# EAGLE schematic ArachnioMini (EAGLE 6.5.0)
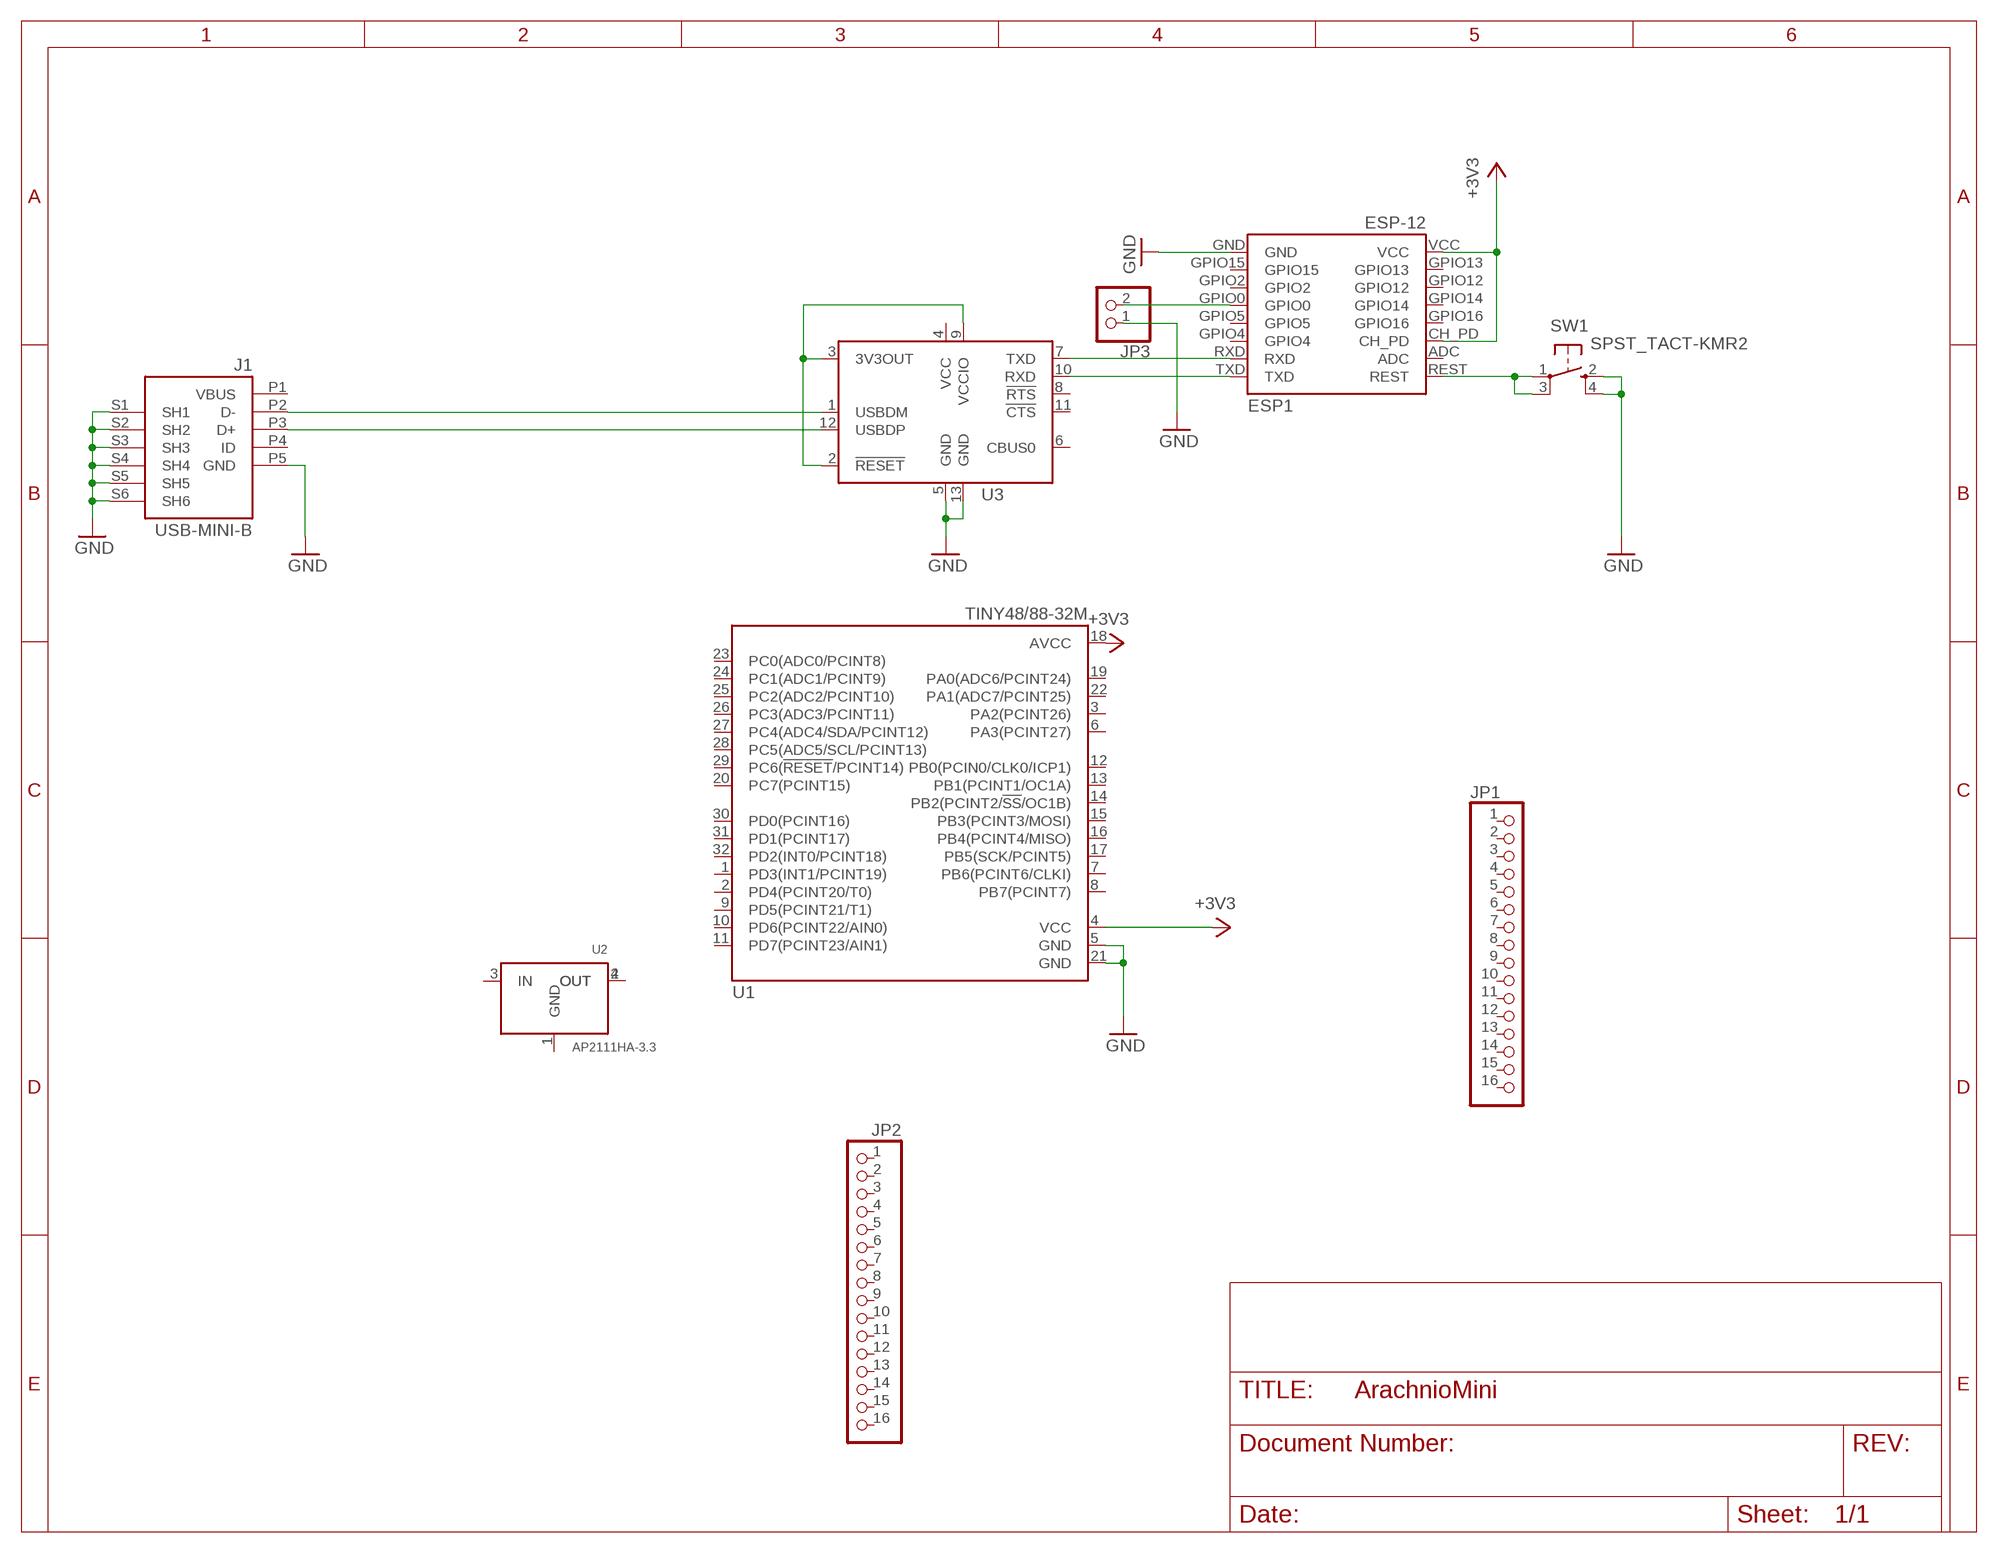
[diagram p0: schematic, sheet 1]

## Parts
ESP1  ESP-12  [ESP-12]
J1  USB-MINI-B  [SMARTPRJ_CON2_USB_MICRO_B_AT]
JP1  PINHD-1X16  [1X16]
JP2  PINHD-1X16  [1X16]
JP3  PINHD-1X2  [1X02]
SW1  SPST_TACT-KMR2  [KMR2]
U1  TINY48/88-32M  [MLF32]
U2  AP2111HA-3.3  [SOT223]
U3  FT234XD  [DFN12]

## Nets
+3V3: ESP1.CH_PD ESP1.VCC U1.4(VCC) U1.18(AVCC)
GND: ESP1.GND J1.P5(GND) J1.S1(SH1) J1.S2(SH2) J1.S3(SH3) J1.S4(SH4) J1.S5(SH5) J1.S6(SH6) JP3.1 SW1.2(S) SW1.4(S1) U1.5(GND) U1.21(GND) U3.5(GND) U3.13(GND)
N$1: ESP1.TXD U3.10(RXD)
N$2: ESP1.RXD U3.7(TXD)
N$3: U3.2(!RESET!) U3.3(3V3OUT) U3.9(VCCIO)
N$4: J1.P3(D+) U3.12(USBDP)
N$5: J1.P2(D-) U3.1(USBDM)
N$6: ESP1.GPIO0 JP3.2
N$7: ESP1.REST SW1.1(P) SW1.3(P1)
Unconnected: ESP1.ADC ESP1.GPIO2 ESP1.GPIO4 ESP1.GPIO5 ESP1.GPIO12 ESP1.GPIO13 ESP1.GPIO14 ESP1.GPIO15 ESP1.GPIO16 J1.P4(ID) JP1.1 JP1.2 JP1.3 JP1.4 JP1.5 JP1.6 JP1.7 JP1.8 JP1.9 JP1.10 JP1.11 JP1.12 JP1.13 JP1.14 JP1.15 JP1.16 JP2.1 JP2.2 JP2.3 JP2.4 JP2.5 JP2.6 JP2.7 JP2.8 JP2.9 JP2.10 JP2.11 JP2.12 JP2.13 JP2.14 JP2.15 JP2.16 U1.1(PD3(INT1/PCINT19)) U1.2(PD4(PCINT20/T0)) U1.3(PA2(PCINT26)) U1.6(PA3(PCINT27)) U1.7(PB6(PCINT6/CLKI)) U1.8(PB7(PCINT7)) U1.9(PD5(PCINT21/T1)) U1.10(PD6(PCINT22/AIN0)) U1.11(PD7(PCINT23/AIN1)) U1.12(PB0(PCIN0/CLK0/ICP1)) U1.13(PB1(PCINT1/OC1A)) U1.14(PB2(PCINT2/!SS!/OC1B)) U1.15(PB3(PCINT3/MOSI)) U1.16(PB4(PCINT4/MISO)) U1.17(PB5(SCK/PCINT5)) U1.19(PA0(ADC6/PCINT24)) U1.20(PC7(PCINT15)) U1.22(PA1(ADC7/PCINT25)) U1.23(PC0(ADC0/PCINT8)) U1.24(PC1(ADC1/PCINT9)) U1.25(PC2(ADC2/PCINT10)) U1.26(PC3(ADC3/PCINT11)) U1.27(PC4(ADC4/SDA/PCINT12)) U1.28(PC5(ADC5/SCL/PCINT13)) U1.29(PC6(!RESET!/PCINT14)) U1.30(PD0(PCINT16)) U1.31(PD1(PCINT17)) U1.32(PD2(INT0/PCINT18)) U2.1(GND) U2.2(OUT) U2.3(IN) U2.4(OUT) U3.4(VCC) U3.6(CBUS0) U3.8(!RTS!) U3.11(!CTS!)

## Power pins joined to a net without a drawn wire
VBUS: J1.P1(VBUS)

## Library data of the parts
ESP1 = esp8266-parts:ESP-12
J1 = logos-ftdi:USB-MINI-B
JP1 JP2 = pinhead:PINHD-1X16: PIN HEADER
JP3 = pinhead:PINHD-1X2: PIN HEADER
SW1 = adafruit:SPST_TACT: SMT 6mm switch, EVQQ2 series http://www.ladyada.net/library/eagle
U1 = atmel:TINY48/88-32
U2 = logos-power:AP2111HA
U3 = logos-ftdi:FT234XD